# EAGLE design LauriFilter (EAGLE 6.5.0)
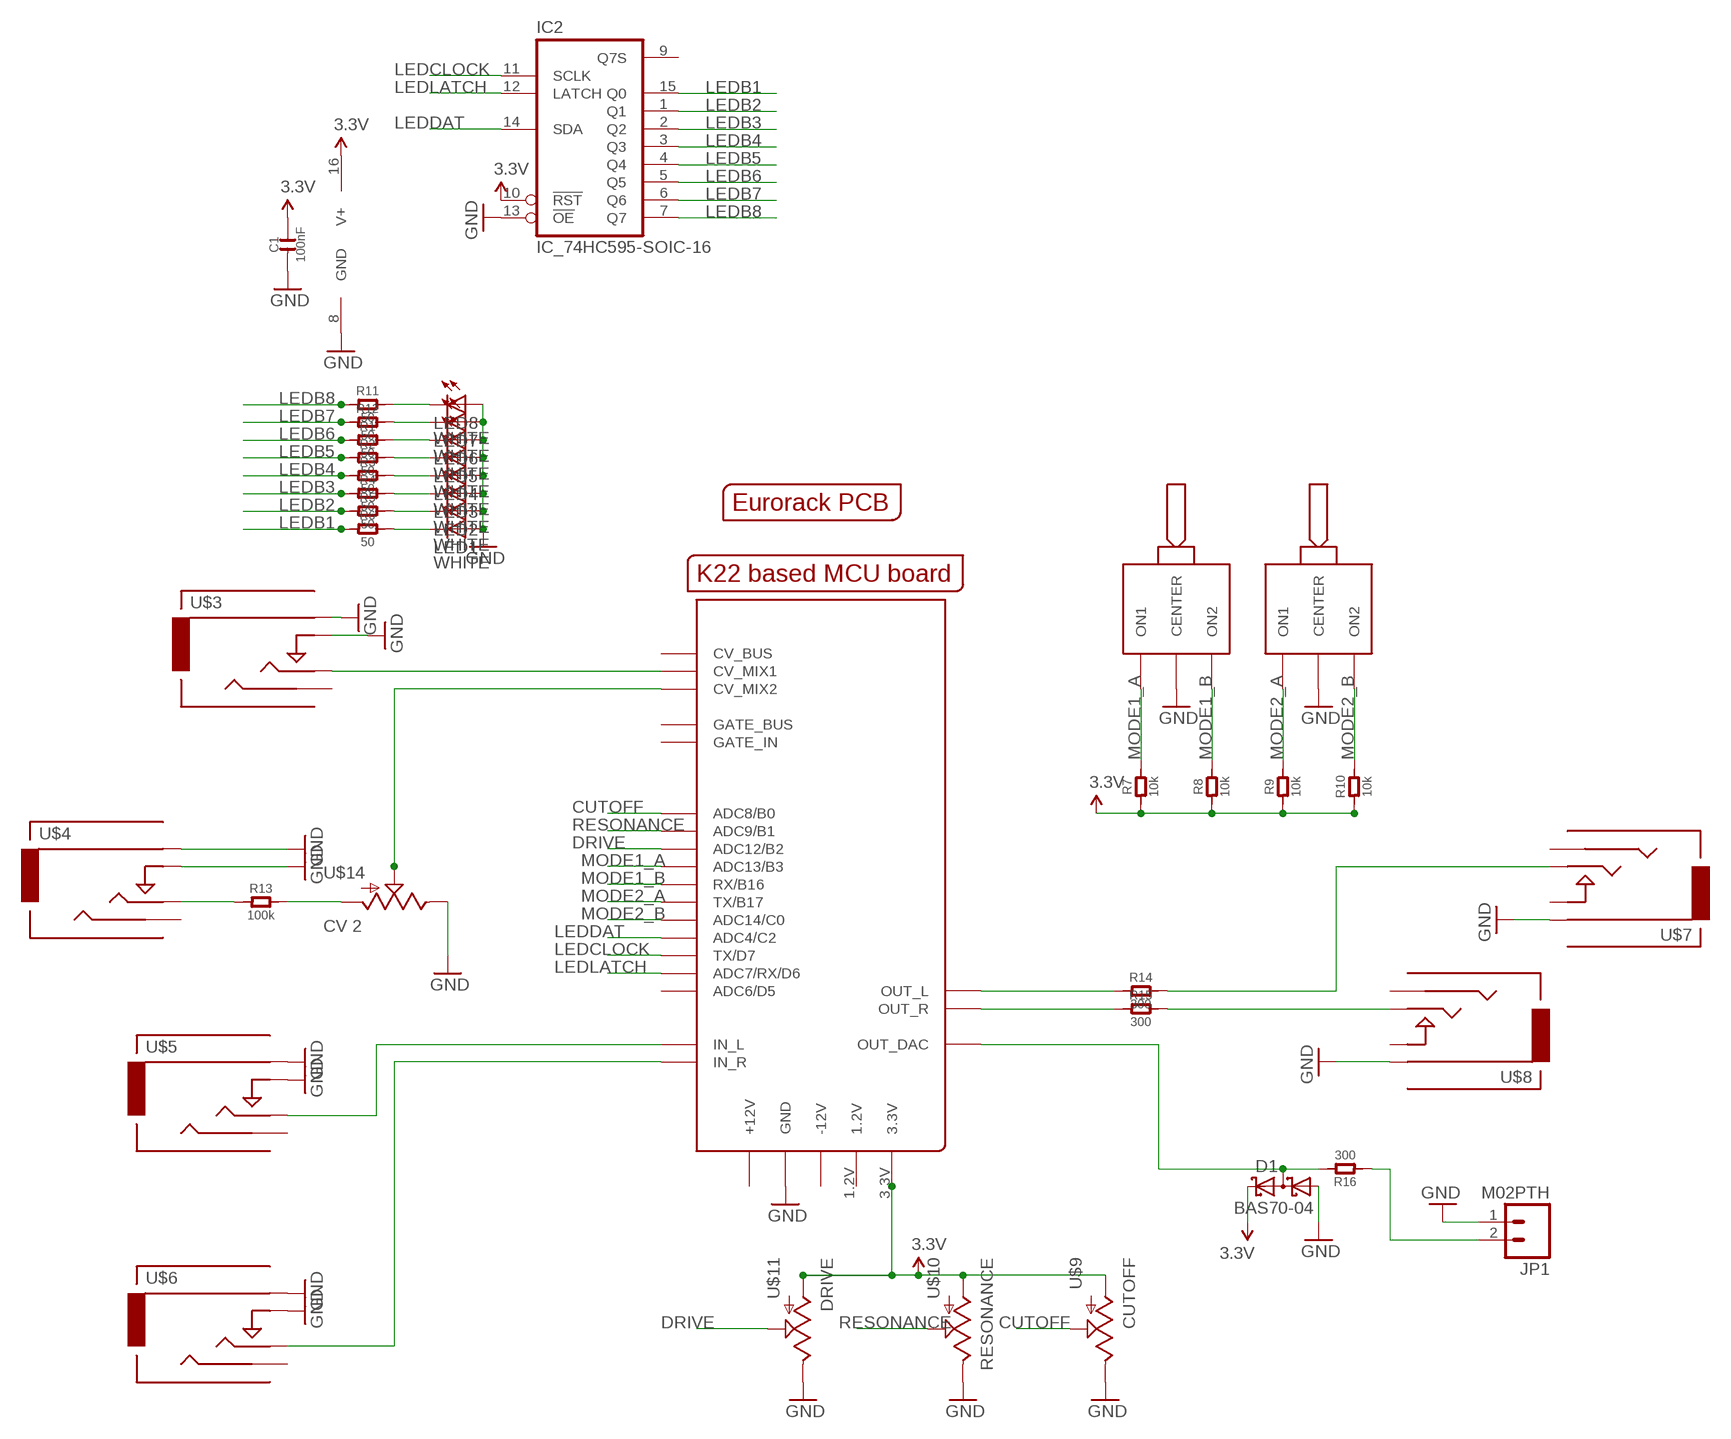
[diagram p0: schematic, sheet 1]

## Parts
C1  100nF  C-0603  [C0603]
D1  BAS70-04  [SOT23]
IC2  IC_74HC595-SOIC-16  [SOIC-16]
JP1  M02PTH  [1X02]
LED1  WHITE  LED3MM  [LED3MM]
LED2  WHITE  LED3MM  [LED3MM]
LED3  WHITE  LED3MM  [LED3MM]
LED4  WHITE  LED3MM  [LED3MM]
LED5  WHITE  LED3MM  [LED3MM]
LED6  WHITE  LED3MM  [LED3MM]
LED7  WHITE  LED3MM  [LED3MM]
LED8  WHITE  LED3MM  [LED3MM]
R1  50  R-0603  [R0603]
R2  50  R-0603  [R0603]
R3  50  R-0603  [R0603]
R4  50  R-0603  [R0603]
R5  50  R-0603  [R0603]
R6  50  R-0603  [R0603]
R7  10k  R-0603  [R0603]
R8  10k  R-0603  [R0603]
R9  10k  R-0603  [R0603]
R10  10k  R-0603  [R0603]
R11  50  R-0603  [R0603]
R12  50  R-0603  [R0603]
R13  100k  R-0603  [R0603]
R14  300  R  [C0805]
R15  300  R  [C0805]
R16  300  R-0603  [R0603]
U$1  MCUBOARD  [MCUBASEBOARD]
U$2  EURORACK_PCB8HP  [EURORACK8HPPCB]
U$3  CV 1  AUDIO-JACKINPUT  [3.5MM-JACK-SWITCH-13MM-INPUT]
U$4  CV 2  AUDIO-JACKINPUT  [3.5MM-JACK-SWITCH-13MM-INPUT]
U$5  IN 1  AUDIO-JACKINPUT  [3.5MM-JACK-SWITCH-13MM-INPUT]
U$6  IN 2  AUDIO-JACKINPUT  [3.5MM-JACK-SWITCH-13MM-INPUT]
U$7  OUT 1  AUDIO-JACKOUTPUT  [3.5MM-JACK-SWITCH-13MM-OUTPUT]
U$8  OUT 2  AUDIO-JACKOUTPUT  [3.5MM-JACK-SWITCH-13MM-OUTPUT]
U$9  CUTOFF  POTZEPHPOT  [OG-POTS_ALPS_POT_VERTICAL]
U$10  RESONANCE  POTZEPHPOT  [OG-POTS_ALPS_POT_VERTICAL]
U$11  DRIVE  POTZEPHPOT  [OG-POTS_ALPS_POT_VERTICAL]
U$12  ONOFFON  [MULTICOMP1MS-ONOFFON]
U$13  ONOFFON  [MULTICOMP1MS-ONOFFON]
U$14  CV 2  POTZEPHPOT  [OG-POTS_ALPS_POT_VERTICAL]

## Nets
3.3V: C1.2 D1.2(C2) IC2.10(!RST) IC2.16(V+) R7.1 R8.1 R9.1 R10.1 U$1.3.3V U$9.P$3(A) U$10.P$3(A) U$11.P$3(A)
CUTOFF: U$1.ADC8(ADC8/B0) U$9.P$2(S)
DRIVE: U$1.ADC12(ADC12/B2) U$11.P$2(S)
GND: C1.1 D1.1(A1) IC2.8(GND) IC2.13(!OE) JP1.1 LED1.A LED2.A LED3.A LED4.A LED5.A LED6.A LED7.A LED8.A U$1.GND@1(GND) U$1.GND@2(GND) U$1.GND@4(GND) U$1.GND@5(GND) U$1.GND@6(GND) U$1.GND@7(GND) U$1.GND@8(GND) U$1.GND@9(GND) U$1.GND_BUS(GND) U$3.RING@1(RING) U$3.RING@2(RING) U$3.SWITCH@1(SWITCH) U$3.SWITCH@2(SWITCH) U$4.RING@1(RING) U$4.RING@2(RING) U$4.SWITCH@1(SWITCH) U$4.SWITCH@2(SWITCH) U$5.RING@1(RING) U$5.RING@2(RING) U$5.SWITCH@1(SWITCH) U$5.SWITCH@2(SWITCH) U$6.RING@1(RING) U$6.RING@2(RING) U$6.SWITCH@1(SWITCH) U$6.SWITCH@2(SWITCH) U$7.RING@1(RING) U$7.RING@2(RING) U$8.RING@1(RING) U$8.RING@2(RING) U$9.P$1(E) U$10.P$1(E) U$11.P$1(E) U$12.2(CENTER) U$13.2(CENTER) U$14.P$1(E)
LEDB1: IC2.15(Q0) R6.1
LEDB2: IC2.1(Q1) R5.1
LEDB3: IC2.2(Q2) R4.1
LEDB4: IC2.3(Q3) R3.1
LEDB5: IC2.4(Q4) R2.1
LEDB6: IC2.5(Q5) R1.1
LEDB7: IC2.6(Q6) R12.1
LEDB8: IC2.7(Q7) R11.1
LEDCLOCK: IC2.11(SCLK) U$1.TX/D7
LEDDAT: IC2.14(SDA) U$1.ADC4(ADC4/C2)
LEDLATCH: IC2.12(LATCH) U$1.ADC7(ADC7/RX/D6)
MODE1_A: R7.2 U$1.ADC13(ADC13/B3) U$12.1(ON1)
MODE1_B: R8.2 U$1.RX/B16 U$12.3(ON2)
MODE2_A: R9.2 U$1.TX/B17 U$13.1(ON1)
MODE2_B: R10.2 U$1.ADC14(ADC14/C0) U$13.3(ON2)
N$1: U$1.IN_L U$5.TIP@1(TIP) U$5.TIP@2(TIP)
N$2: U$1.IN_R U$6.TIP@1(TIP) U$6.TIP@2(TIP)
N$3: U$1.CV_MIX1 U$3.TIP@1(TIP) U$3.TIP@2(TIP)
N$4: U$1.CV_MIX2 U$14.P$2(S)
N$5: R14.2 U$7.TIP@1(TIP) U$7.TIP@2(TIP)
N$6: R15.2 U$8.TIP@1(TIP) U$8.TIP@2(TIP)
N$7: R13.1 U$4.TIP@1(TIP) U$4.TIP@2(TIP)
N$8: LED8.K(C) R11.2
N$9: LED7.K(C) R12.2
N$10: R13.2 U$14.P$3(A)
N$11: R14.1 U$1.OUT_L
N$12: R15.1 U$1.OUT_R
N$13: D1.3(C1A2) R16.2 U$1.OUT_DAC
N$14: LED6.K(C) R1.2
N$15: LED5.K(C) R2.2
N$16: LED4.K(C) R3.2
N$17: LED3.K(C) R4.2
N$18: LED2.K(C) R5.2
N$19: LED1.K(C) R6.2
N$20: JP1.2 R16.1
RESONANCE: U$1.ADC9(ADC9/B1) U$10.P$2(S)
Unconnected: IC2.9(Q7S) U$1.1.2V U$1.+12V@1(+12V) U$1.+12V@2(+12V) U$1.-12V@1(-12V) U$1.-12V@2(-12V) U$1.ADC6(ADC6/D5) U$1.CVBUS(CV_BUS) U$1.GATE_BUS U$1.GATE_IN U$3.SECOND@1(SECOND) U$3.SECOND@2(SECOND) U$4.SECOND@1(SECOND) U$4.SECOND@2(SECOND) U$5.SECOND@1(SECOND) U$5.SECOND@2(SECOND) U$6.SECOND@1(SECOND) U$6.SECOND@2(SECOND) U$7.SECOND@1(SECOND) U$7.SECOND@2(SECOND) U$7.SWITCH@1(SWITCH) U$7.SWITCH@2(SWITCH) U$8.SECOND@1(SECOND) U$8.SECOND@2(SECOND) U$8.SWITCH@1(SWITCH) U$8.SWITCH@2(SWITCH)

## Library data of the parts
C1 = OPL:C*
D1 = diode:BAS70-04: Silicon Schottky Diodes General-purpose diode for high-speed switching
IC2 = dp_devices:IC_74HC595: 8-bit serial-in parallel out shift register, output latch 3-state
JP1 = SparkFun-Connectors:M02: Standard 2-pin 0.1" header. Use with - straight break away headers ( PRT-00116) - right angle break away headers (PRT-00553) - swiss pins (PRT-00743) - machine pins (PRT-00117) - female headers (PRT-00115) Molex polarized connector foot print use with: PRT-08233 with associated crimp pins and housings. 2.54_SCREWTERM for use with PRT-10571. 3.5mm Screw Terminal footprints for PRT-08084 5mm Screw Terminal footprints for use with PRT-08433
LED1-LED8 = SparkFun-LED:LED: LEDs Standard schematic elements and footprints for 5mm, 3mm, 1206, and 0603 sized LEDs. 5mm - Spark Fun Electronics SKU : COM-00529 (and others)
R1-R16 = OPL:R*
U$1 = EurorackModularParts:MCUBOARD
U$2 = EurorackModularParts:EURORACK_PCB
U$3-U$8 = EurorackModularParts:AUDIO-JACK: Switching Mono 3.5mm Audio Jack from Erthenvar.
U$9-U$11 U$14 = EurorackModularParts:POT
U$12 U$13 = EurorackModularParts:ONOFFON

## Net classes
0 default: width 0.203 mm

## Board
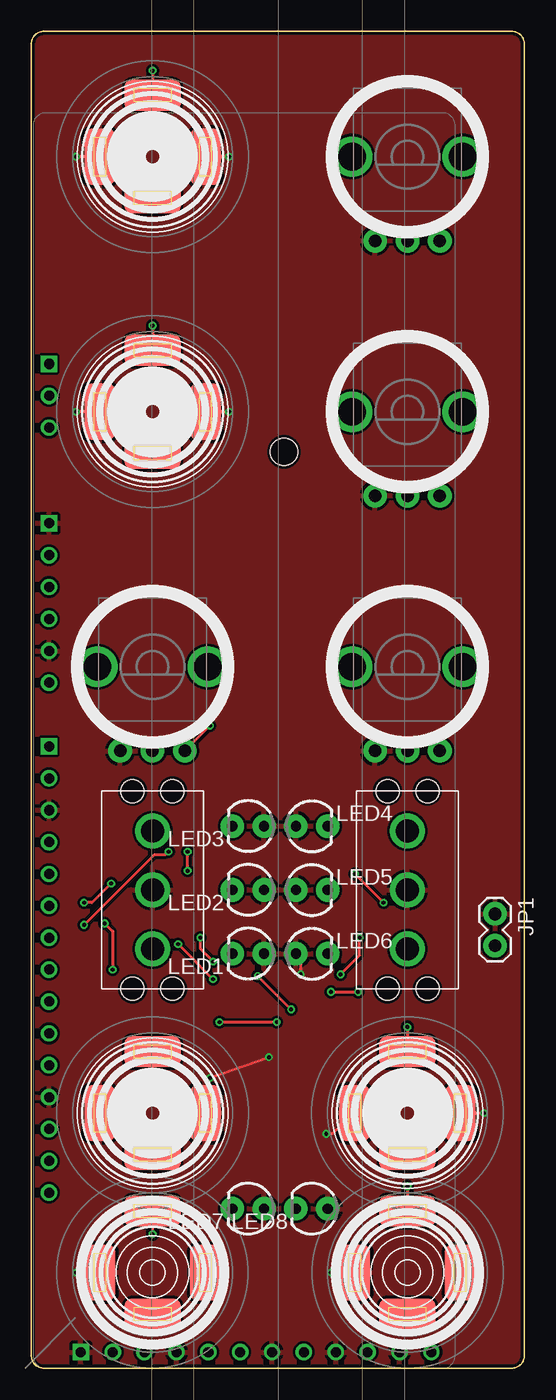
[diagram p1: board, top side]
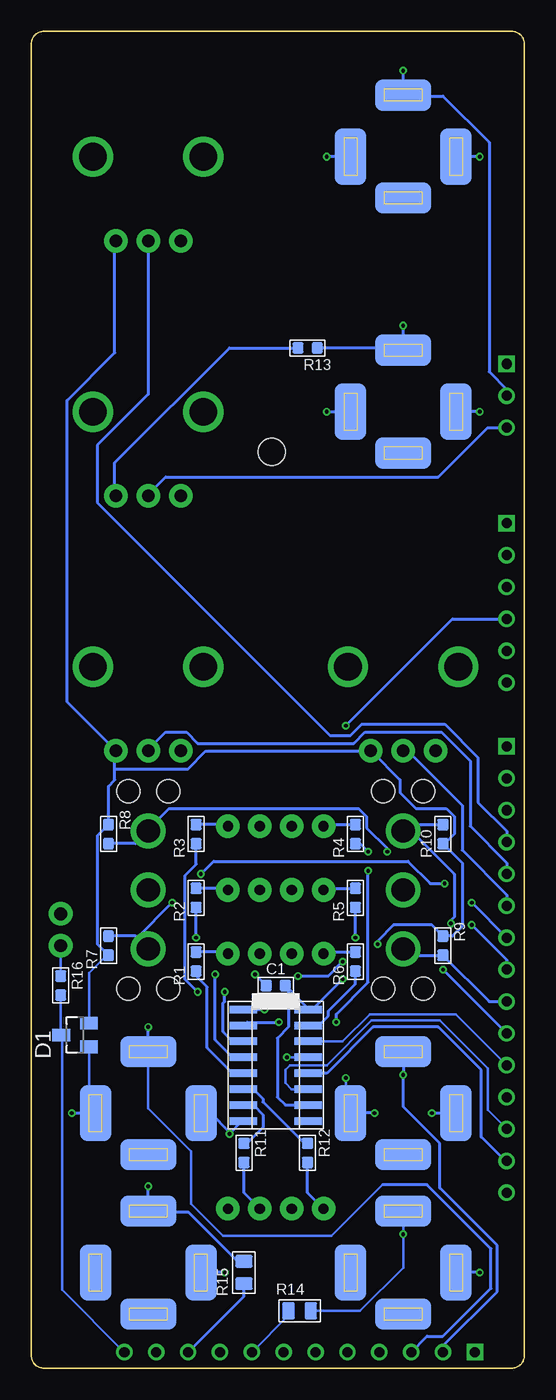
[diagram p2: board, bottom side, seen from below]

Size 39.3 x 106.5 mm. Coordinates in mm from the lower left corner, seen from the top.
Copper layers (1*16): Top 0.035mm / dielectric 1.5mm / Bottom 0.035mm
Design rules "FrontPanel *": minimum track width 6mil, minimum drill 12mil, track to track 8mil, track to pad 8mil, pad to pad 8mil, via to via 8mil, smd to smd 0mil, copper to edge 9mil, drill to drill 9mil, minimum pad ring 10mil, minimum via ring 6mil, stop-mask expansion 2mil, vias tented up to drill 100mil, thermal gap 10mil

### Footprints (pad centres in the part's own frame; a part is rotated, then mirrored left to right if it is on the bottom)
C0603 = smd 0.889 x 0.889: 1 -0.762,0; 2 0.762,0
SOT23 = smd 1 x 1.4: 1 -0.95,-1.1; 2 0.95,-1.1; 3 0,1.1
SOIC-16 = smd 0.6 x 2.2: 1 -4.445,-2.6; 2 -3.175,-2.6; 3 -1.905,-2.6; 4 -0.635,-2.6; 5 0.635,-2.6; 6 1.905,-2.6; 7 3.175,-2.6; 8 4.445,-2.6; 9 4.445,2.6; 10 3.175,2.6; 11 1.905,2.6; 12 0.635,2.6; 13 -0.635,2.6; 14 -1.905,2.6; 15 -3.175,2.6; 16 -4.445,2.6
1X02 = drill 1.016 pad 1.88: 1 0,0; 2 2.54,0
LED3MM = drill 0.813 pad 1.88: A -1.27,0; K 1.27,0
R0603 = smd 0.889 x 0.889: 1 -0.762,0; 2 0.762,0
C0805 = smd 1.016 x 1.397: 1 -0.889,0; 2 0.889,0
MCUBASEBOARD = drill 0.8: 1.2V 1.27,54.61; 3.3V 1.27,59.69; +12V@1 13.97,1.27; +12V@2 1.27,64.77; -12V@1 16.51,1.27; -12V@2 1.27,62.23; ADC4 1.27,24.13; ADC6 1.27,13.97; ADC7 1.27,16.51; ADC8 1.27,41.91; ADC9 1.27,39.37; ADC12 1.27,36.83; ADC13 1.27,34.29; ADC14 1.27,26.67; CV_MIX1 1.27,77.47; CV_MIX2 1.27,74.93; GATE_IN 1.27,46.99; GND@2 11.43,1.27; GND@4 24.13,1.27; GND@5 29.21,1.27; GND@6 1.27,57.15; GND@7 1.27,44.45; GND@8 1.27,21.59; GND@9 19.05,1.27; IN_L 6.35,1.27; IN_R 8.89,1.27; OUT_DAC 31.75,1.27; OUT_L 21.59,1.27; OUT_R 26.67,1.27; RX/B16 1.27,31.75; TX/B17 1.27,29.21; TX/D7 1.27,19.05 | drill 0.8 square: CVBUS 1.27,80.01; GATE_BUS 1.27,49.53; GND@1 3.81,1.27; GND_BUS 1.27,67.31 | hole 2.2: 20,73
3.5MM-JACK-SWITCH-13MM-INPUT = smd 2.5 x 4.5: RING@1 -4.2,0; SWITCH@1 4.2,0 | smd 2.5 x 4.5 bottom: RING@2 -4.2,0; SWITCH@2 4.2,0 | smd 4.5 x 2.5: SECOND@1 0,-3.3; TIP@1 0,4.9 | smd 4.5 x 2.5 bottom: SECOND@2 0,-3.3; TIP@2 0,4.9
3.5MM-JACK-SWITCH-13MM-OUTPUT = smd 2.5 x 4.5: RING@1 -4.2,0; SWITCH@1 4.2,0 | smd 2.5 x 4.5 bottom: RING@2 -4.2,0; SWITCH@2 4.2,0 | smd 4.5 x 2.5: SECOND@1 0,-3.3; TIP@1 0,4.9 | smd 4.5 x 2.5 bottom: SECOND@2 0,-3.3; TIP@2 0,4.9
OG-POTS_ALPS_POT_VERTICAL = drill 1 pad 1.88: P$1 -2.58,-6.7; P$2 0,-6.7; P$3 2.58,-6.7 | drill 2.2 pad 3.175: P$4 4.4,0; P$5 -4.4,0
MULTICOMP1MS-ONOFFON = drill 1.85: 1 -4.7,0; 2 0,0; 3 4.7,0 | hole 1.85: -7.875,1.59; -7.875,-1.59; 7.875,1.59; 7.875,-1.59

### Placement (x,y rotation side)
C1  19.82,30.48 0 bottom
D1  35.82,26.54 90 bottom
IC2  19.82,24.13 270 bottom
JP1  36.97,36.2 270 top
LED1  17.28,33.02 180 top
LED2  17.28,38.1 180 top
LED3  17.28,43.18 180 top
LED4  22.36,43.18 0 top
LED5  22.36,38.1 0 top
LED6  22.36,33.02 0 top
LED7  17.28,12.7 180 top
LED8  22.36,12.7 180 top
R1  26.17,32.38 90 bottom
R2  26.17,37.47 90 bottom
R3  26.17,42.55 90 bottom
R4  13.47,42.55 90 bottom
R5  13.47,37.47 90 bottom
R6  13.47,32.38 90 bottom
R7  33.16,33.66 90 bottom
R8  33.16,42.55 270 bottom
R9  6.49,33.66 270 bottom
R10  6.49,42.55 90 bottom
R11  22.36,17.14 270 bottom
R12  17.28,17.14 270 bottom
R13  17.28,81.28 180 bottom
R14  17.91,4.57 0 bottom
R15  22.36,7.62 90 bottom
R16  36.97,30.48 270 bottom
U$1  0.14,0 0 top
U$2  -0.5,0 0 top
U$3  9.66,96.52 0 top
U$4  9.66,76.2 0 top
U$5  9.66,20.32 0 top
U$6  29.98,20.32 0 top
U$7  9.66,7.62 0 top
U$8  29.98,7.62 0 top
U$9  29.98,96.52 0 top
U$10  29.98,55.88 0 top
U$11  9.66,55.88 0 top
U$12  29.98,38.1 90 top
U$13  9.66,38.1 90 top
U$14  29.98,76.2 0 top

### Tracks (layer width: path | path; a pad name or v marks a point on that pad's centre or on a via)
3.3V  (via drill 0.3)
  Top 0.254: v14.23,51.18 12.33,49.28 U$11.P$3 | v11.69,33.78 v14.49,30.99
  Bottom 0.203: D1.2 34.68,27.56 34.68,31.5 33.28,32.89 R7.1
  Bottom 0.254: IC2.10 19.06,20.95 19.69,21.59 19.69,26.29 18.8,27.18 18.8,30.1 C1.2 17.15,28.57 IC2.16 17.15,28.7 16.77,28.7 v14.49,30.99 | U$1.3.3V 5.72,59.69 v14.23,51.18 | v11.69,33.78 11.69,34.04 10.42,35.31 7.37,35.31 R9.1 5.72,34.42 4.96,35.18 4.96,40.26 R10.1 6.36,41.78 5.6,42.55 5.6,43.94 6.23,44.58 8.64,44.58 9.91,45.85 9.91,46.86 12.2,49.15 U$11.P$3 12.33,49.15 25.41,49.15 26.8,47.75 32.65,47.75 | R7.1 34.04,33.78 34.04,42.42 R8.1 33.16,46.35 32.65,46.86 32.65,47.75 | 32.65,47.75 32.65,49.15 U$10.P$3 32.65,49.28 36.46,53.09 36.46,77.09 32.65,80.9 32.65,89.79 U$9.P$3
CUTOFF
  Bottom 0.254: U$1.ADC8 1.41,42.8 3.69,45.09 3.69,48.64 6.36,51.31 12.96,51.31 13.85,50.42 15.5,50.42 34.04,68.96 34.04,73.53 29.98,77.6 U$9.P$2
DRIVE
  Bottom 0.254: U$1.ADC12 1.41,37.72 4.96,41.27 4.96,44.83 9.28,49.15 9.66,49.15 U$11.P$2
GND  (via drill 0.3)
  Top 0.203: v14.23,23.11 v18.93,24.77
  Top 0.254: v21.47,31.37 21.47,32.64 LED6.A | v15.76,96.52 U$3.SWITCH@2 | v23.5,18.67 24.01,18.67 25.66,20.32 U$6.RING@2 | U$7.RING@2 v3.56,7.62 | U$5.RING@2 v7.37,20.32 | U$8.RING@2 v23.88,7.62 | U$5.SWITCH@2 v11.95,20.32 | U$6.SWITCH@2 v36.08,20.32 | U$4.RING@2 v3.56,76.2 | U$4.SWITCH@2 v15.76,76.2 | U$3.RING@2 v3.56,96.52
  Bottom 0.203: v18.93,24.77 IC2.13 | v14.23,23.11 14.23,20.57 13.98,20.32 U$5.SWITCH@2 | 34.68,20.32 34.68,25.53 D1.1
  Bottom 0.254: v21.47,31.37 C1.1 | U$3.SWITCH@2 v15.76,96.52 | IC2.8 22.49,19.68 v23.5,18.67 23.5,18.8 25.03,20.32 U$6.RING@2 | v3.56,7.62 U$7.RING@2 | v7.37,20.32 U$5.RING@2 | v23.88,7.62 U$8.RING@2 | v11.95,20.32 U$5.SWITCH@2 | v36.08,20.32 34.68,20.32 U$6.SWITCH@2 | v3.56,76.2 U$4.RING@2 | v15.76,76.2 U$4.SWITCH@2 | v3.56,96.52 U$3.RING@2
  pour Top: -0.5,106.68 40.14,106.68 40.14,-1.27 -0.5,-1.27
LEDB1
  Bottom 0.254: R6.1 13.47,30.61 15.63,28.45 15.63,28.07 16.39,27.3 IC2.15
LEDB2  (via drill 0.3)
  Top 0.254: v13.47,34.29 13.47,33.4 v14.49,32.38 | v20.71,28.57 v18.04,31.24
  Bottom 0.254: v13.47,34.29 R5.1 | v14.49,32.38 15.63,31.24 v18.04,31.24 | IC2.1 v20.71,28.57
LEDB3  (via drill 0.3)
  Top 0.254: v12.45,39.62 v12.45,41.15 | v19.57,27.56 v14.99,27.56
  Bottom 0.254: R4.1 13.09,41.78 v12.45,41.15 | v12.45,39.62 12.45,30.73 14.99,28.19 v14.99,27.56 | v19.57,27.56 22.11,27.56 22.36,27.3 IC2.2
LEDB4  (via drill 0.3)
  Top 0.254: v23.88,29.97 v26.04,29.97
  Bottom 0.254: R3.1 26.17,40.13 27.06,39.24 27.06,30.99 v26.04,29.97 | v23.88,29.97 23.88,29.21 24.01,29.08 24.01,26.8 23.25,26.04 IC2.3
LEDB5  (via drill 0.3)
  Top 0.254: v26.17,34.29 26.17,32.89 v24.65,31.37
  Bottom 0.254: v26.17,34.29 R2.1 | v24.65,31.37 24.65,26.16 23.25,24.77 IC2.4
LEDB6
  Bottom 0.254: R1.1 26.17,31.24 25.28,30.35 25.28,25.53 23.25,23.5 IC2.5
LEDB7
  Bottom 0.254: R12.1 17.53,17.91 20.84,21.21 20.84,21.46 21.6,22.23 IC2.6
LEDB8
  Bottom 0.254: R11.1 22.11,17.91 20.84,19.18 20.84,20.19 21.6,20.95 IC2.7
LEDCLOCK
  Bottom 0.203: U$1.TX/D7 2.93,20.57 2.93,23.88 6.74,27.69 12.2,27.69 15.76,24.13 18.68,24.13 19.06,23.75 19.06,22.73 18.55,22.23 IC2.11
LEDDAT
  Bottom 0.203: IC2.14 14.49,26.04 12.33,28.19 5.47,28.19 U$1.ADC4
LEDLATCH
  Bottom 0.254: U$1.ADC7 1.53,16.51 3.44,18.41 3.44,23.75 6.87,27.18 12.07,27.18 15.76,23.5 IC2.12
MODE1_A  (via drill 0.3)
  Top 0.254: v4.2,37.08 4.83,37.08 v6.36,38.61 | v28.07,37.08 v25.79,39.37
  Bottom 0.254: R7.2 31,34.42 30.87,34.29 | 30.87,34.29 U$12.1 30.87,34.29 | v4.2,37.08 U$1.ADC13 | v6.36,38.61 7.5,38.61 9.28,40.39 24.77,40.39 v25.79,39.37 | 30.87,34.29 v28.07,37.08
MODE1_B  (via drill 0.3)
  Top 0.254: v4.2,35.31 9.79,40.89 10.68,40.89 v10.93,41.15
  Bottom 0.254: R8.2 31,41.78 U$12.3 29.98,42.93 28.33,44.58 13.22,44.58 12.58,43.94 12.58,43.05 10.93,41.4 v10.93,41.15 | U$1.RX/B16 1.41,32.51 v4.2,35.31
MODE2_A
  Bottom 0.254: U$13.1 9.66,33.27 9.28,32.89 R9.2 2.8,29.21 U$1.TX/B17
MODE2_B  (via drill 0.3)
  Top 0.254: v6.49,31.75 6.49,34.8 v5.85,35.43
  Bottom 0.254: R10.2 9.28,43.31 9.41,43.18 | 9.41,43.18 9.66,42.93 U$13.3 9.41,43.18 | v6.49,31.75 U$1.ADC14 | v5.85,35.43 5.85,35.69 5.6,35.94 5.6,39.37 9.41,43.18
N$1  (via drill 0.3)
  Top 0.254: v9.66,23.37 U$5.TIP@2
  Bottom 0.254: U$1.IN_L 6.49,1.78 2.17,6.1 2.17,9.78 6.74,14.35 6.74,17.91 9.66,20.83 v9.66,23.37 U$5.TIP@2
N$2  (via drill 0.3)
  Top 0.254: v29.98,27.18 U$6.TIP@2
  Bottom 0.203: 11.31,14.61 15.38,10.54 24.01,10.54 26.55,13.08 26.55,17.27 29.98,20.7 U$6.TIP@2
  Bottom 0.254: U$6.TIP@2 v29.98,27.18 | U$1.IN_R 7.76,2.54 6.49,2.54 2.67,6.35 2.67,9.53 7.76,14.61 11.31,14.61
N$3  (via drill 0.3)
  Top 0.254: v9.66,103.38 U$3.TIP@2
  Bottom 0.254: U$1.CV_MIX1 1.41,77.98 2.8,79.38 2.8,97.66 6.49,101.35 9.66,101.35 U$3.TIP@2 v9.66,103.38
N$4
  Bottom 0.254: U$1.CV_MIX2 2.93,74.93 6.87,70.99 28.58,70.99 29.98,69.6 U$14.P$2
N$5  (via drill 0.3)
  Top 0.203: v9.66,10.67 U$7.TIP@2
  Bottom 0.203: R14.2 13.09,4.57 9.66,8 v9.66,10.67 U$7.TIP@2
N$6  (via drill 0.3)
  Top 0.254: v29.98,14.48 U$8.TIP@2
  Bottom 0.254: R15.2 22.87,8.51 26.8,12.45 29.98,12.45 U$8.TIP@2 v29.98,14.48
N$7  (via drill 0.3)
  Top 0.254: v9.66,83.06 U$4.TIP@1
  Bottom 0.254: R13.1 9.79,81.28 9.66,81.15 U$4.TIP@1 v9.66,83.06
N$8
  Bottom 0.254: R11.2 22.36,13.97 LED8.K
N$9
  Bottom 0.254: R12.2 17.28,13.97 LED7.K
N$10
  Bottom 0.254: R13.2 23.5,81.28 32.65,72.14 32.65,69.6 U$14.P$3
N$11
  Bottom 0.203: R14.1 18.8,4.19 U$1.OUT_L
N$12
  Bottom 0.254: R15.1 22.36,5.71 U$1.OUT_R
N$13
  Bottom 0.203: R16.2 36.97,26.54 D1.3 36.84,26.54 36.84,6.22 U$1.OUT_DAC
N$14
  Bottom 0.254: R1.2 23.76,33.15 LED6.K
N$15
  Bottom 0.254: R2.2 23.76,38.23 LED5.K
N$16
  Bottom 0.254: R3.2 23.76,43.31 LED4.K
N$17
  Bottom 0.254: R4.2 15.88,43.31 LED3.K
N$18
  Bottom 0.254: R5.2 15.88,38.23 LED2.K
N$19
  Bottom 0.254: R6.2 15.88,33.15 LED1.K
N$20
  Bottom 0.203: JP1.2 R16.1
RESONANCE
  Bottom 0.254: U$1.ADC9 1.41,40.26 4.33,43.18 4.33,48.39 6.61,50.67 12.71,50.67 13.6,49.78 26.04,49.78 26.93,50.67 28.58,50.67 29.98,49.28 U$10.P$2